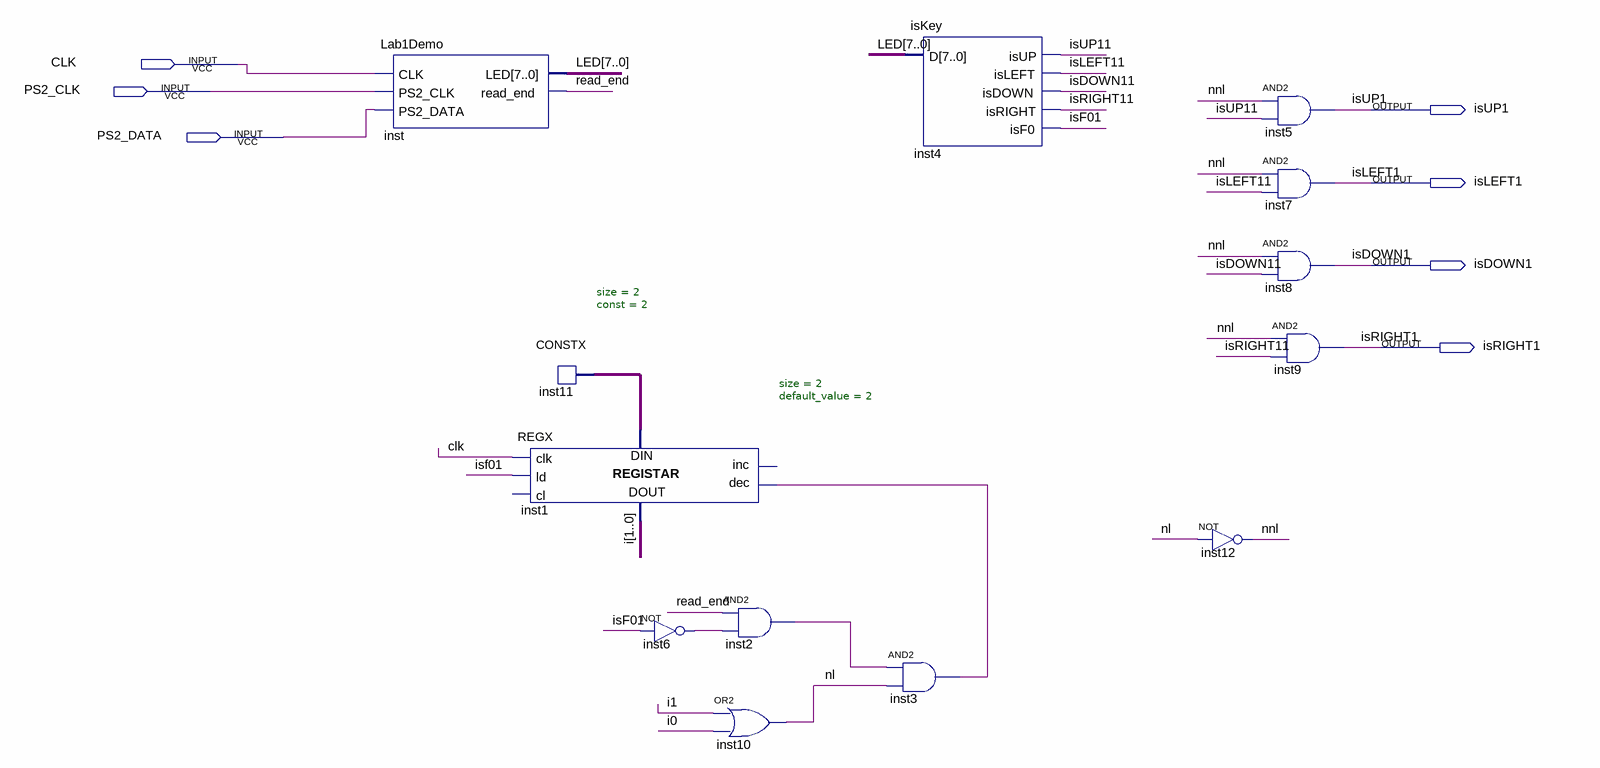
[diagram p0: schematic sheet]
// Quartus schematic lab1demoupgrade.bdf as structural Verilog: 13 symbols, 7 pins
module lab1demoupgrade (
  input  CLK,
  input  PS2_CLK,
  input  PS2_DATA,
  output isUP1,
  output isLEFT1,
  output isDOWN1,
  output isRIGHT1
);

  wire inst2_out, inst3_out, inst6_out, isDOWN11, isF01, isLEFT11, isRIGHT11, isUP11, nl, nnl, read_end;
  wire [1:0] i, inst11_data;
  wire [7:0] LED;

  Lab1Demo inst (.CLK(CLK), .PS2_CLK(PS2_CLK), .PS2_DATA(PS2_DATA), .LED(LED), .read_end(read_end));
  CONSTX #(.size(2), .\const (2)) inst11 (.data(inst11_data));
  REGX #(.size(2), .default_value(2)) inst1 (
    .clk(CLK), .ld(isF01), .dec(inst3_out), .data_in(inst11_data), .data_out(i));  // open: cl, inc
  not inst6 (inst6_out, isF01);
  and inst2 (inst2_out, read_end, inst6_out);
  or inst10 (nl, i[1], i[0]);
  isKey inst4 (.D(LED), .isUP(isUP11), .isLEFT(isLEFT11), .isDOWN(isDOWN11), .isRIGHT(isRIGHT11), .isF0(isF01));
  and inst3 (inst3_out, inst2_out, nl);
  not inst12 (nnl, nl);
  and inst5 (isUP1, nnl, isUP11);
  and inst7 (isLEFT1, nnl, isLEFT11);
  and inst8 (isDOWN1, nnl, isDOWN11);
  and inst9 (isRIGHT1, nnl, isRIGHT11);
endmodule
